# Altium project DM1098EMB_R0M0E0.PrjPcb (part 3 of 3)

## Sheet DM1098EMB_IO.SchDoc: =project_title
size Tabloid; CompanyName: Luxonis Holding; DrawnBy: Brian Weinstein; Organization: Luxonis Holding; Address1: 1925 Harmony Park Drive; Address2: Westminster, CO; Address3: 80234; Address4: United States; DocumentNumber: D1098EMB; Revision: R0M0E0; SheetNumber: 6; SheetTotal: 6
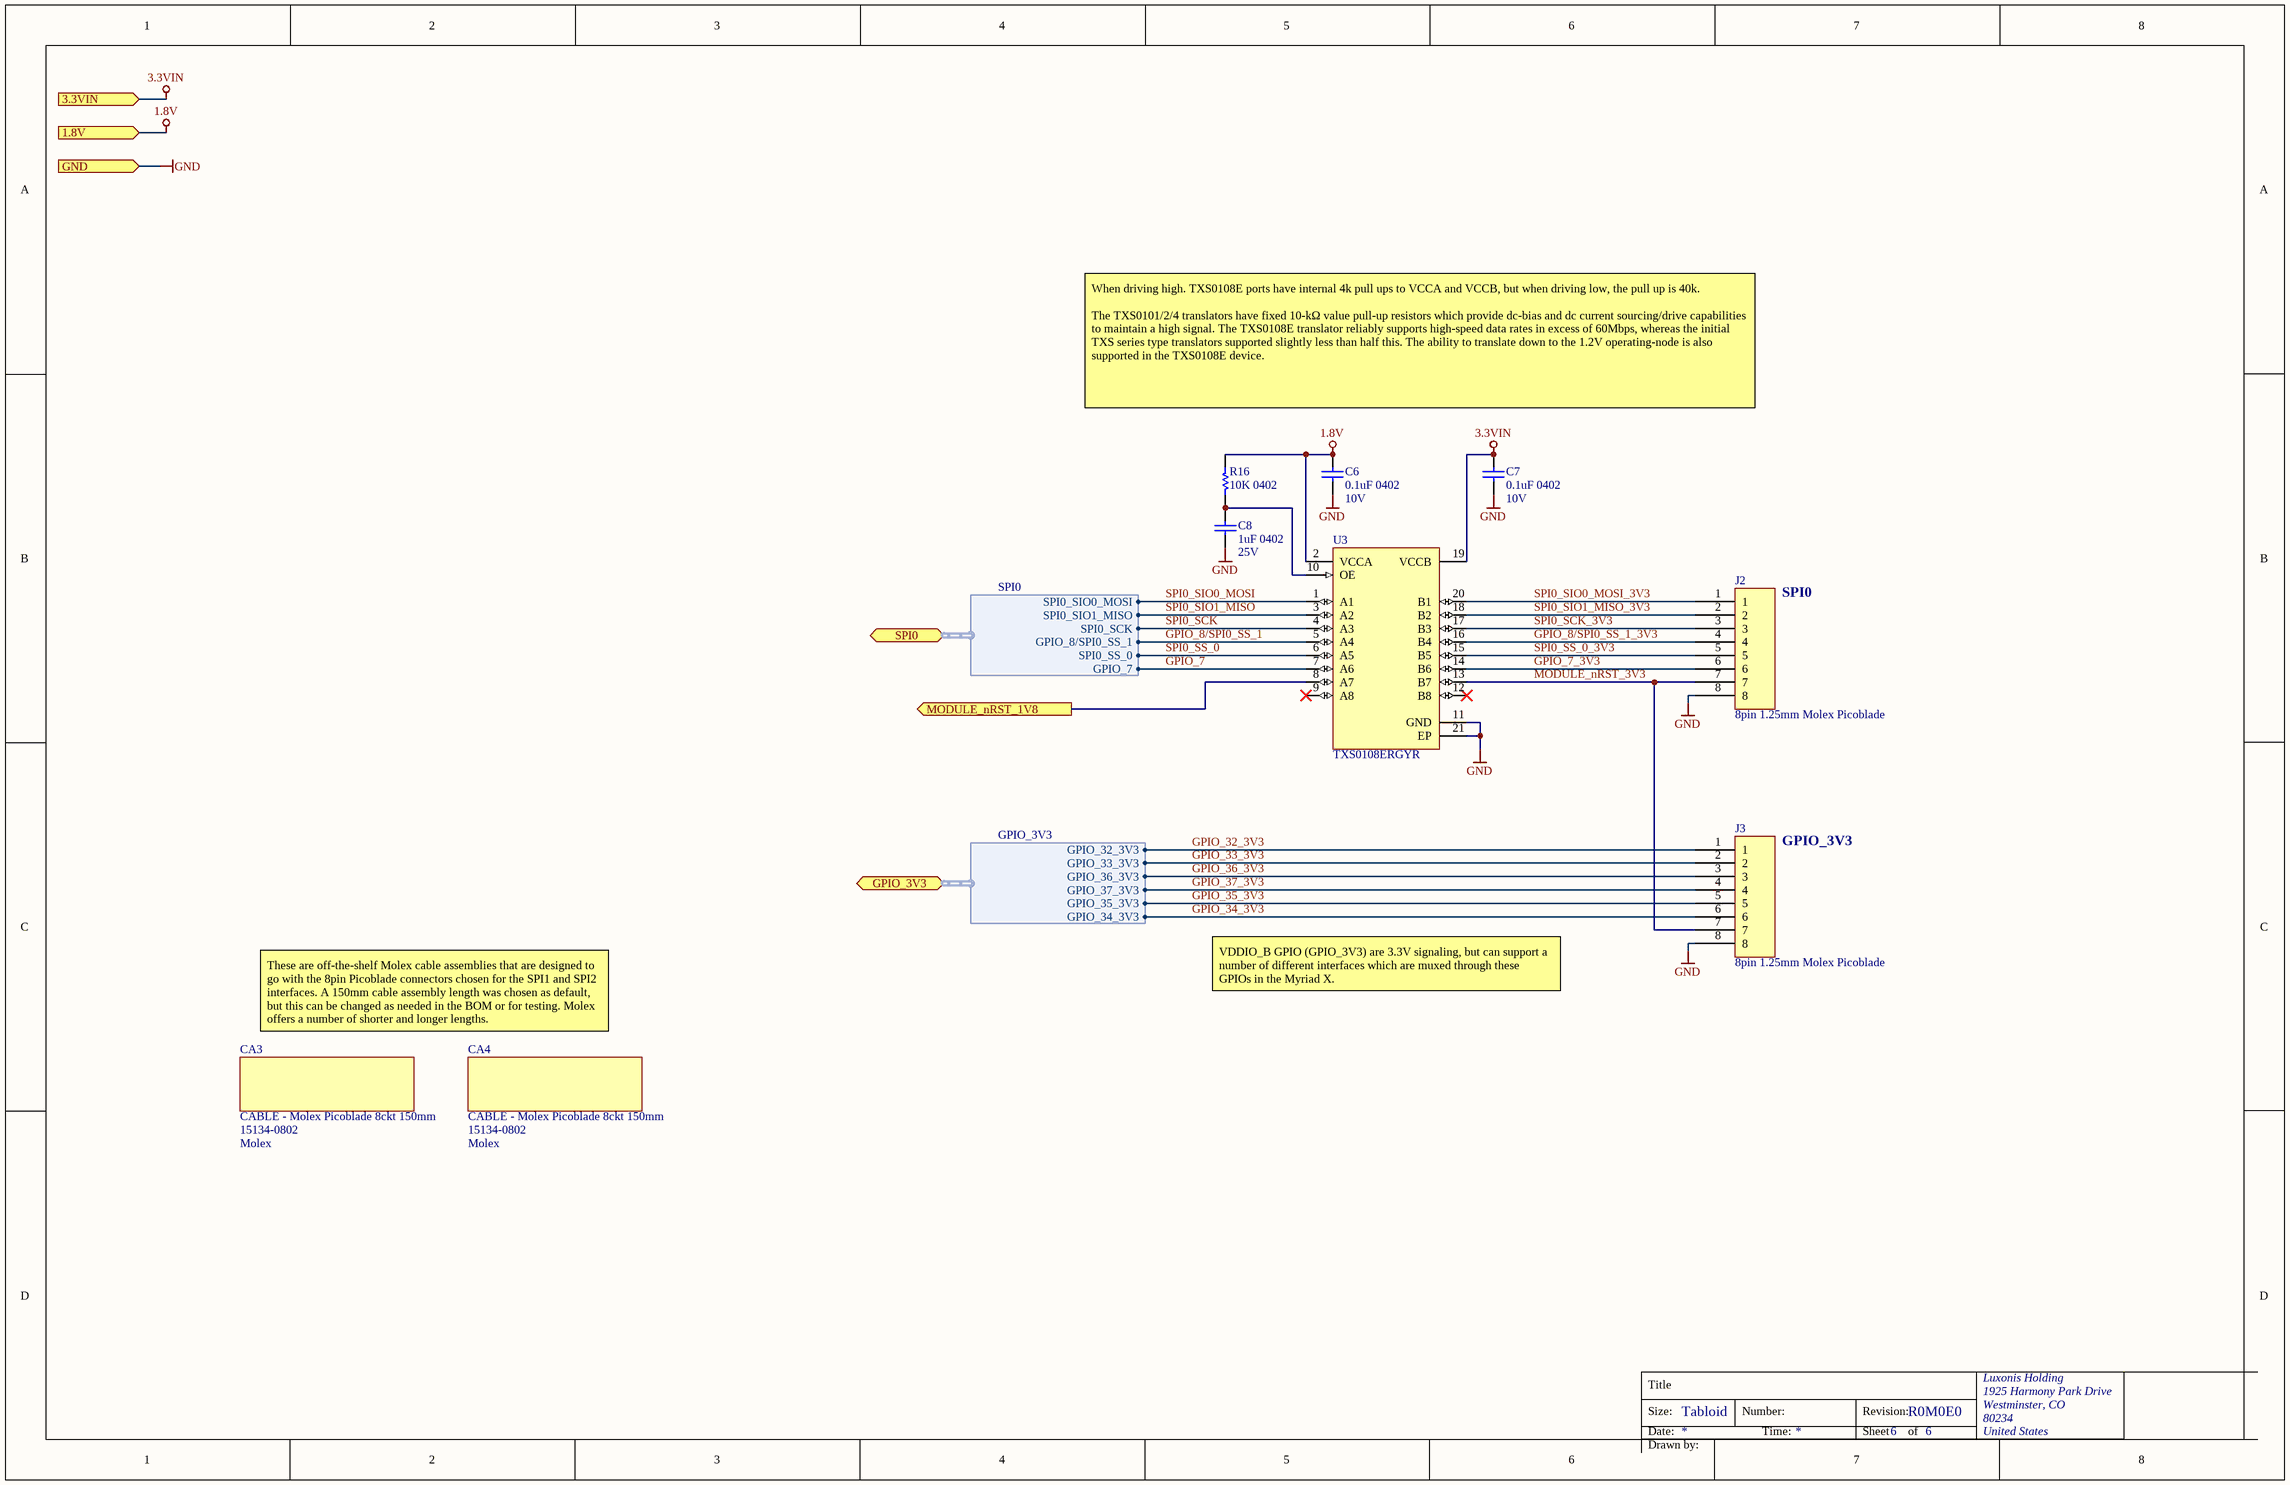
[diagram p5: DM1098EMB_IO.SchDoc]

### Parts
C6  0.1uF 0402  Voltage Rating: 10V  [CAPC0402(1005)70_N]
C7  0.1uF 0402  Voltage Rating: 10V  [CAPC0402(1005)70_N]
C8  1uF 0402  Voltage Rating: 25V  [CAPC0402(1005)70_N]
CA3  CABLE - Molex Picoblade 8ckt 150mm  Manufacturer 1: Molex  [15134-0802]  (mechanical)
CA4  CABLE - Molex Picoblade 8ckt 150mm  Manufacturer 1: Molex  [15134-0802]  (mechanical)
J2  8pin 1.25mm Molex Picoblade  [53047-0810]
J3  8pin 1.25mm Molex Picoblade  [53047-0810]
R16  10K 0402  [RESC0402(1005)_N]
U3  TXS0108ERGYR  [TXS0108ERGYR]

### Ports
1.8V (in), 3.3VIN (in), GND (in), GPIO_3V3 (bidir, harness GPIO_3V3), MODULE_nRST_1V8 (out), SPI0 (bidir, harness SPI0)

### Harnesses
SPI0: SPI0_SIO0_MOSI, SPI0_SIO1_MISO, SPI0_SCK, GPIO_8/SPI0_SS_1, SPI0_SS_0, GPIO_7
GPIO_3V3: GPIO_32_3V3, GPIO_33_3V3, GPIO_36_3V3, GPIO_37_3V3, GPIO_35_3V3, GPIO_34_3V3

### Nets
1.8V: C6.2 R16.1 U3.2(VCCA) ; port 1.8V  [project net 1V8]
3.3VIN: C7.2 U3.19(VCCB) ; port 3.3VIN
GND: C6.1 C7.1 C8.1 J2.8 J3.8 U3.11(GND) U3.21(EP) ; port GND
GPIO_7: U3.7(A6) ; port SPI0.GPIO_7
GPIO_7_3V3: J2.6 U3.14(B6)
GPIO_8/SPI0_SS_1: U3.5(A4) ; port SPI0.GPIO_8/SPI0_SS_1
GPIO_8/SPI0_SS_1_3V3: J2.4 U3.16(B4)
GPIO_32_3V3: J3.1 ; port GPIO_3V3.GPIO_32_3V3
GPIO_33_3V3: J3.2 ; port GPIO_3V3.GPIO_33_3V3
GPIO_34_3V3: J3.6 ; port GPIO_3V3.GPIO_34_3V3
GPIO_35_3V3: J3.5 ; port GPIO_3V3.GPIO_35_3V3
GPIO_36_3V3: J3.3 ; port GPIO_3V3.GPIO_36_3V3
GPIO_37_3V3: J3.4 ; port GPIO_3V3.GPIO_37_3V3
MODULE_nRST_1V8: U3.8(A7) ; port MODULE_nRST_1V8
MODULE_nRST_3V3: J2.7 J3.7 U3.13(B7)
SPI0_SCK: U3.4(A3) ; port SPI0.SPI0_SCK
SPI0_SCK_3V3: J2.3 U3.17(B3)
SPI0_SIO0_MOSI: U3.1(A1) ; port SPI0.SPI0_SIO0_MOSI
SPI0_SIO0_MOSI_3V3: J2.1 U3.20(B1)
SPI0_SIO1_MISO: U3.3(A2) ; port SPI0.SPI0_SIO1_MISO
SPI0_SIO1_MISO_3V3: J2.2 U3.18(B2)
SPI0_SS_0: U3.6(A5) ; port SPI0.SPI0_SS_0
SPI0_SS_0_3V3: J2.5 U3.15(B5)
NetC8_2: C8.2 R16.2 U3.10(OE)

Not connected (* = marked no-connect by the designer): U3 9(A8)* 12(B8)*

### Notes on the sheet
- When driving high. TXS0108E ports have internal 4k pull ups to VCCA and VCCB, but when driving low, the pull up is 40k.
  The TXS0101/2/4 translators have fixed 10-kΩ value pull-up resistors which provide dc-bias and dc current sourcing/drive capabilities to maintain a high signal. The TXS0108E translator reliably supports high-speed data rates in excess of 60Mbps, whereas the initial TXS series type translators supported slightly less than half this. The ability to translate down to the 1.2V operating-node is also supported in the TXS0108E device.
- (near J2) SPI0
- (near J3) GPIO_3V3
- These are off-the-shelf Molex cable assemblies that are designed to go with the 8pin Picoblade connectors chosen for the SPI1 and SPI2 interfaces. A 150mm cable assembly length was chosen as default, but this can be changed as needed in the BOM or for testing. Molex offers a number of shorter and longer lengths.
- VDDIO_B GPIO (GPIO_3V3) are 3.3V signaling, but can support a number of different interfaces which are muxed through these GPIOs in the Myriad X.
- Title
- Size:
- Date:
- Tabloid
- Number:
- Time:
- Revision:
- Sheet
- of
- Drawn by:

### Library data of the parts
C6 C7 = GRM155R71A104JA01D: CAP CER 0.1UF 10V X7R 0402 5%; Manufacturer 1: Murata; Capacitance: 100nF; Supplier 1: Digi-Key; Manufacturer Part Number 1: GRM155R71A104JA01D; Stock 1: 1346709; Pricing 1: 1=0.10000, 10=0.02500, 100=0.01130, 500=0.00806, 1000=0.00633, 2500=0.00575, 5000=0.00529 (USD); RoHS: Yes; Mount: Surface Mount; Case/Package: 0402; Case Code (Imperial): 0402; Case Code (Metric): 1005; Min Operating Temperature: -55°C; Max Operating Temperature: 125°C; Tolerance: 5%; Packaging: Tape and Reel; Voltage Rating (DC): 10V; Dielectric: X7R; Package Quantity: 10000; Termination: SMD/SMT; Length: 1mm; Height: 0.5mm; Width: 0.02inch; Thickness: 0.022inch; Depth: 0.5mm; Radiation Hardening: No; Lead Free: Lead Free; ComponentLink1URL: https://datasheet.ciiva.com/5411/product-5411135.pdf?src-supplier=Mouser; ComponentLink1Description: https://datasheet.ciiva.com/5411/product-5411135.pdf?src-supplier=Mouser; ComponentLink2URL: https://datasheet.ciiva.com/11618/c02e-11618821.pdf?src-supplier=Avnet; ComponentLink2Description: https://datasheet.ciiva.com/11618/c02e-11618821.pdf?src-supplier=Avnet; Supplier Part Number 1: 490-10777-1-ND
C8 = GRM155R61E105KA12D: CAP CER 1UF 25V X5R 0402 10%; Manufacturer 1: Murata; Material: Ceramic; Supplier 1: Digi-Key; Manufacturer Part Number 1: GRM155R61E105KA12D; Stock 1: 200653; Pricing 1: 1=0.10000, 10=0.07100, 100=0.03350, 500=0.02352, 1000=0.01947, 2500=0.01812, 5000=0.01658 (USD); RoHS: Yes; Mount: Surface Mount; Case/Package: 0402; Weight: 0.000212oz; Case Code (Metric): 1005; Case Code (Imperial): 0402; Min Operating Temperature: -55°C; Max Operating Temperature: 85°C; Tolerance: 10%; Capacitance: 1uF; Dielectric: X5R; Voltage Rating (DC): 25V; Packaging: Tape and Reel; Package Quantity: 10000; Termination: SMD/SMT; Voltage: 25V; Length: 1mm; Height: 0.5mm; Width: 0.5mm; Thickness: 0.022inch; Depth: 0.5mm; Lead Free: Lead Free; REACH SVHC: No SVHC; ComponentLink1URL: https://datasheet.ciiva.com/22732/1666664-22732122.pdf?src-supplier=Element14; ComponentLink1Description: https://datasheet.ciiva.com/22732/1666664-22732122.pdf?src-supplier=Element14; ComponentLink2URL: https://datasheet.ciiva.com/7719/1666664-7719006.pdf?src-supplier=Element14; ComponentLink2Description: https://datasheet.ciiva.com/7719/1666664-7719006.pdf?src-supplier=Element14; Supplier Part Number 1: 490-10017-1-ND; Supplier 2: Arrow; Supplier 3: TTI; Supplier Part Number 2: GRM155R61E105KA12D; Supplier Part Number 3: GRM155R61E105KA12D
CA3 CA4 = 15134-0802: CABLE ASSY POWER CORD, 8P CRIMP SOCKET, 150MM, BLK; Supplier 1: Digi-Key; Stock 1: 1432; Pricing 1: 1=5.34000, 10=5.12300, 25=4.69560, 50=4.48220, 100=4.26880, 250=3.73520, 500=3.62848, 1000=3.09488, 2500=2.88144 (USD); RoHS: Yes; Color: Black; ComponentLink1URL: http://www.farnell.com/datasheets/2549566.pdf?src-supplier=Farnell; ComponentLink1Description: http://www.farnell.com/datasheets/2549566.pdf?src-supplier=Farnell; Supplier 2: Mouser; Supplier Part Number 1: WM15274-ND; Supplier Part Number 2: 538-15134-0802; Manufacturer Part Number 1: 15134-0802; Lead Free: Lead Free
J2 J3 = 53047-0810: CONN HEADER VERT 8POS 1.25MM  Connector Header Through Hole 8 position 0.049" (1.25mm); Number of Contacts: 8; Contact Resistance: 20mR; Gender: Male; Current Rating: 1A; Voltage Rating: 125V; Insulation Resistance: 100MR; Glow Wire Compliant: Non-compliant; Supplier 1: Digi-Key; Manufacturer 1: Molex; Manufacturer Part Number 1: 53047-0810; Stock 1: 10707; Pricing 1: 1=0.54000, 10=0.50500, 100=0.38690, 500=0.33644, 1000=0.27756, 5000=0.24392, 10000=0.22710 (USD); RoHS: Yes; Mount: Through Hole; Case/Package: 0810; Contact Plating: Tin; Contact Material: Bronze,Brass,Tin; Color: Natural; Housing Color: Natural; Housing Material: Polyamide; Min Operating Temperature: -40°C; Max Operating Temperature: 85°C; Termination: Through Hole; Number of Rows: 1; Orientation: Vertical; Packaging: Tray; Number of Positions: 8; Package Quantity: 2000; Voltage Rating (DC): 125V; Number of Circuits: 8; Pitch: 1.25mm; Radiation Hardening: No; REACH SVHC: Unknown; Lead Free: Lead Free; Flammability Rating: UL94 V-0; ComponentLink1URL: https://datasheet.ciiva.com/30110/64290530470810-pcb-headers-30110449.pdf?src-supplier=Onlinecomponents.com; ComponentLink1Description: https://datasheet.ciiva.com/30110/64290530470810-pcb-headers-30110449.pdf?src-supplier=Onlinecomponents.com; ComponentLink2URL: https://datasheet.ciiva.com/5155/0530470810-pcb-headers-170988-5155236.pdf?src-supplier=Mouser; ComponentLink2Description: https://datasheet.ciiva.com/5155/0530470810-pcb-headers-170988-5155236.pdf?src-supplier=Mouser; ComponentLink3URL: https://datasheet.ciiva.com/11747/0900766b8024e2fd-11747012.pdf?src-supplier=RSComponents; ComponentLink3Description: https://datasheet.ciiva.com/11747/0900766b8024e2fd-11747012.pdf?src-supplier=RSComponents; ComponentLink4URL: https://datasheet.ciiva.com/25291/1815828-25291355.pdf?src-supplier=Newark; ComponentLink4Description: https://datasheet.ciiva.com/25291/1815828-25291355.pdf?src-supplier=Newark; ComponentLink5URL: https://datasheet.ciiva.com/34303/1932504-34303339.pdf?src-supplier=Jameco; ComponentLink5Description: https://datasheet.ciiva.com/34303/1932504-34303339.pdf?src-supplier=Jameco; ComponentLink6URL: https://datasheet.ciiva.com/16658/0530470810-pcb-headers-16658422.pdf?src-supplier=Avnet+Europe; ComponentLink6Description: https://datasheet.ciiva.com/16658/0530470810-pcb-headers-16658422.pdf?src-supplier=Avnet+Europe; ComponentLink7URL: https://datasheet.ciiva.com/17025/70266944-17025467.pdf?src-supplier=Allied+Electronics; ComponentLink7Description: https://datasheet.ciiva.com/17025/70266944-17025467.pdf?src-supplier=Allied+Electronics; ComponentLink8URL: https://datasheet.ciiva.com/14156/ge116819-116832-e-14156239.pdf?src-supplier=Distrelec; ComponentLink8Description: https://datasheet.ciiva.com/14156/ge116819-116832-e-14156239.pdf?src-supplier=Distrelec; Supplier 2: Mouser; Supplier Part Number 1: WM1737-ND; Supplier Part Number 2: 538-53047-0810
R16 = RC0402FR-1310KL: RES SMD 10K OHM 1% 0402 1/16W Chip Resistor, 0402 [1005 Metric], 10 kohm, RC Series, 50 V, Thick Film, 62.5 mW; Manufacturer 1: Yageo; Resistance: 10kR; Temperature Coefficient: 100ppm/°C; Power Rating: 62.5mW; Voltage Rating: 50V; ComponentLink1URL: https://datasheet.ciiva.com/16940/pyu-rc0402-51-rohs-l-6-16940293.pdf?src-supplier=Avnet+Europe; ComponentLink1Description: https://datasheet.ciiva.com/16940/pyu-rc0402-51-rohs-l-6-16940293.pdf?src-supplier=Avnet+Europe; ComponentLink2URL: https://datasheet.ciiva.com/28386/pyu-rc0402-51-rohs-l-6-28386855.pdf?src-supplier=Avnet+Europe; ComponentLink2Description: https://datasheet.ciiva.com/28386/pyu-rc0402-51-rohs-l-6-28386855.pdf?src-supplier=Avnet+Europe; ComponentLink3URL: https://datasheet.ciiva.com/16740/pyu-rc0402-51-rohs-l-6-r-16740602.pdf?src-supplier=Future+Electronics; ComponentLink3Description: https://datasheet.ciiva.com/16740/pyu-rc0402-51-rohs-l-6-r-16740602.pdf?src-supplier=Future+Electronics; ComponentLink4URL: https://datasheet.ciiva.com/8891/pyu-rc0402-51-rohs-l-6-8891339.pdf?src-supplier=Avnet; ComponentLink4Description: https://datasheet.ciiva.com/8891/pyu-rc0402-51-rohs-l-6-8891339.pdf?src-supplier=Avnet; ComponentLink5URL: https://datasheet.ciiva.com/5557/pyu-rc0402-51-rohs-l-6-r-5557997.pdf?src-supplier=Mouser; ComponentLink5Description: https://datasheet.ciiva.com/5557/pyu-rc0402-51-rohs-l-6-r-5557997.pdf?src-supplier=Mouser; ComponentLink6URL: https://datasheet.ciiva.com/7983/1018594-7983533.pdf?src-supplier=Element14; ComponentLink6Description: https://datasheet.ciiva.com/7983/1018594-7983533.pdf?src-supplier=Element14; Supplier 1: Newark; Manufacturer Part Number 1: RC0402FR-1310KL; Stock 1: 62239; Pricing 1: 1=0.10000, 25=0.01200, 100=0.00400, 250=0.00400, 500=0.00300, 1000=0.00300 (USD); RoHS: Yes; Case/Package: 0402; Number of Pins: 2; Contact Plating: Tin,Matte,Lead; Case Code (Imperial): 0402; Case Code (Metric): 1005; Min Operating Temperature: -55°C; Max Operating Temperature: 155°C; Tolerance: 1%; Composition: Thick Film; Packaging: Tape and Reel; Termination: SMD/SMT; Military Standard: Not; Voltage Rating (DC): 50V; Working Voltage: 50V; Number of Terminations: 2; Length: 1mm; Depth: 0.5mm; Radiation Hardening: No; REACH SVHC: No SVHC; Lead Free: Lead Free; Supplier Part Number 1: 67R9960; Supplier 2: Future Electronics; Supplier 3: Mouser; Supplier 4: Element14; Supplier Part Number 2: RC0402FR-1310KL-CUTT; Supplier Part Number 3: 603-RC0402FR-1310KL; Supplier Part Number 4: 1799235
U3 = TXS0108ERGYR: IC TRNSLTR BIDIRECTIONAL 20VQFN; Manufacturer 1: Texas Instruments; Logic Function: Translator; Number of Bits: 8; Turn-On Delay Time: 312ns; High Level Output Current: -50mA; Low Level Output Current: 50mA; Quiescent Current: 3uA; Propagation Delay: 4.8ns; Min Supply Voltage: 1.2V; Max Supply Voltage: 5.5V; Data Rate: 60Mbps; Output Type: Voltage; Supplier 1: Digi-Key; Manufacturer Part Number 1: TXS0108ERGYR; RoHS: Yes; Category: Integrated Circuits (ICs); Stock 1: 122729; Pricing 1: 1=1.42000, 10=1.26600, 25=1.20120, 100=0.98670, 250=0.92236, 500=0.81510, 1000=0.64350 (USD); Mount: Surface Mount; Case/Package: VQFN; Number of Pins: 20; Weight: 0.001517oz; Min Operating Temperature: -40°C; Max Operating Temperature: 85°C; Number of Inputs: 8; Packaging: Tape and Reel; Package Quantity: 1; Number of Channels: 8; Radiation Hardening: No; Lead Free: Lead Free; REACH SVHC: No SVHC; ComponentLink1URL: https://datasheet.ciiva.com/15096/getdatasheetpartid-189651-15096225.pdf?src-supplier=Verical; ComponentLink1Description: https://datasheet.ciiva.com/15096/getdatasheetpartid-189651-15096225.pdf?src-supplier=Verical; ComponentLink2URL: https://datasheet.ciiva.com/22659/1718976-22659572.pdf?src-supplier=Element14; ComponentLink2Description: https://datasheet.ciiva.com/22659/1718976-22659572.pdf?src-supplier=Element14; ComponentLink3URL: https://datasheet.ciiva.com/26185/txs0108e-26185177.pdf?src-supplier=Avnet+Europe; ComponentLink3Description: https://datasheet.ciiva.com/26185/txs0108e-26185177.pdf?src-supplier=Avnet+Europe; ComponentLink4URL: https://datasheet.ciiva.com/14287/txs0108e-14287692.pdf?src-supplier=Avnet; ComponentLink4Description: https://datasheet.ciiva.com/14287/txs0108e-14287692.pdf?src-supplier=Avnet; ComponentLink5URL: https://datasheet.ciiva.com/1899/txs0108e-1899610.pdf?src-supplier=Digi-Key; ComponentLink5Description: https://datasheet.ciiva.com/1899/txs0108e-1899610.pdf?src-supplier=Digi-Key; ComponentLink6URL: https://datasheet.ciiva.com/1899/txs0108e-1899611.pdf?src-supplier=Digi-Key; ComponentLink6Description: https://datasheet.ciiva.com/1899/txs0108e-1899611.pdf?src-supplier=Digi-Key; ComponentLink7URL: https://datasheet.ciiva.com/1899/txs0108e-1899612.pdf?src-supplier=Digi-Key; ComponentLink7Description: https://datasheet.ciiva.com/1899/txs0108e-1899612.pdf?src-supplier=Digi-Key; ComponentLink8URL: https://datasheet.ciiva.com/14287/txs0108e-14287533.pdf?src-supplier=Avnet; ComponentLink8Description: https://datasheet.ciiva.com/14287/txs0108e-14287533.pdf?src-supplier=Avnet; ComponentLink9URL: https://datasheet.ciiva.com/48701/001073880-da-01-en-ic-xlatr-volt-lv-txs0108ergyr-qfn-20-tid-48701964.pdf?src-supplier=Conrad; ComponentLink9Description: https://datasheet.ciiva.com/48701/001073880-da-01-en-ic-xlatr-volt-lv-txs0108ergyr-qfn-20-tid-48701964.pdf?src-supplier=Conrad; Supplier 2: Digi-Key; Supplier 3: Arrow; Supplier 4: TI store; Supplier 5: Mouser; Supplier Part Number 1: 296-24806-1-ND; Supplier Part Number 2: 296-24806-2-ND; Supplier Part Number 3: TXS0108ERGYR; Supplier Part Number 4: TXS0108ERGYR; Supplier Part Number 5: 595-TXS0108ERGYR

## Nets that join several sheets
1V8: DM1098EMB_TopLevel (C10.2 TP7.1 U4.5), DM1098EMB_Connector (B2.1), DM1098EMB_IO (C6.2 R16.1 U3.2)
3.3VIN: DM1098EMB_TopLevel (6 pins), DM1098EMB_USB (C74.2 R186.2 U61.6), DM1098EMB_IO (C7.2 U3.19)
GND: DM1098EMB_TopLevel (27 pins), DM1098EMB_Connector (34 pins), DM1098EMB_USB (21 pins), DM1098EMB_MIPI_CAM (40 pins), DM1098EMB_IO (7 pins)
VBUS: DM1098EMB_TopLevel (TP14.1 U2.3 U5.1), DM1098EMB_Connector (J1.53), DM1098EMB_USB (10 pins)
VDD_5V: DM1098EMB_TopLevel (12 pins), DM1098EMB_Connector (8 pins), DM1098EMB_USB (C76.2 R213.2 R214.2 U62.12), DM1098EMB_MIPI_CAM (6 pins)
2485_PGOOD: DM1098EMB_TopLevel (M3.1), DM1098EMB_Connector (J1.37 J10.5)
CAM_A_CLK_OUT: DM1098EMB_Connector (J1.28), DM1098EMB_MIPI_CAM (D9.5 D9.6 J6.10)
CAM_A_PWDN_N: DM1098EMB_Connector (J1.34), DM1098EMB_MIPI_CAM (D9.4 D9.7 J6.9)
CAM_B_CLK_OUT: DM1098EMB_Connector (J1.73), DM1098EMB_MIPI_CAM (6 pins)
CAM_B_D_PWM: DM1098EMB_Connector (J1.65), DM1098EMB_MIPI_CAM (J9.12)
CAM_B_PWDN_N: DM1098EMB_Connector (J1.67), DM1098EMB_MIPI_CAM (J8.12)
CAM_L_C_N: DM1098EMB_Connector (J1.95), DM1098EMB_MIPI_CAM (D6.5 D6.6 J8.2)
CAM_L_C_P: DM1098EMB_Connector (J1.97), DM1098EMB_MIPI_CAM (D6.4 D6.7 J8.3)
CAM_L_D0_N: DM1098EMB_Connector (J1.89), DM1098EMB_MIPI_CAM (D6.2 D6.9 J8.5)
CAM_L_D0_P: DM1098EMB_Connector (J1.91), DM1098EMB_MIPI_CAM (D6.1 D6.10 J8.6)
CAM_L_D1_N: DM1098EMB_Connector (J1.83), DM1098EMB_MIPI_CAM (D3.2 D3.9 J8.16)
CAM_L_D1_P: DM1098EMB_Connector (J1.85), DM1098EMB_MIPI_CAM (D3.1 D3.10 J8.17)
CAM_R_C_N: DM1098EMB_Connector (J1.96), DM1098EMB_MIPI_CAM (D8.5 D8.6 J9.2)
CAM_R_C_P: DM1098EMB_Connector (J1.98), DM1098EMB_MIPI_CAM (D8.4 D8.7 J9.3)
CAM_R_D0_N: DM1098EMB_Connector (J1.90), DM1098EMB_MIPI_CAM (D8.2 D8.9 J9.5)
CAM_R_D0_P: DM1098EMB_Connector (J1.92), DM1098EMB_MIPI_CAM (D8.1 D8.10 J9.6)
CAM_R_D1_N: DM1098EMB_Connector (J1.84), DM1098EMB_MIPI_CAM (D10.2 D10.9 J9.16)
CAM_R_D1_P: DM1098EMB_Connector (J1.86), DM1098EMB_MIPI_CAM (D10.1 D10.10 J9.17)
COM_AUX_IO2: DM1098EMB_Connector (J1.42 TP5.1), DM1098EMB_MIPI_CAM (R2.1)
GPIO_7: DM1098EMB_Connector (J1.59), DM1098EMB_MIPI_CAM (R1.2), DM1098EMB_IO (U3.7)
GPIO_8/SPI0_SS_1: DM1098EMB_Connector (J1.60), DM1098EMB_IO (U3.5)
GPIO_32_3V3: DM1098EMB_Connector (J1.61), DM1098EMB_IO (J3.1)
GPIO_33_3V3: DM1098EMB_Connector (J1.63), DM1098EMB_IO (J3.2)
GPIO_34_3V3: DM1098EMB_Connector (J1.40), DM1098EMB_IO (J3.6)
GPIO_35_3V3: DM1098EMB_Connector (J1.38), DM1098EMB_IO (J3.5)
GPIO_36_3V3: DM1098EMB_Connector (J1.36), DM1098EMB_IO (J3.3)
GPIO_37_3V3: DM1098EMB_Connector (J1.32), DM1098EMB_IO (J3.4)
GPIO_53: DM1098EMB_Connector (J1.69 J10.7), DM1098EMB_MIPI_CAM (R5.2)
I2C1_SCL: DM1098EMB_Connector (J1.35), DM1098EMB_MIPI_CAM (J6.6)
I2C1_SDA: DM1098EMB_Connector (J1.33), DM1098EMB_MIPI_CAM (J6.7)
I2C2_SCL: DM1098EMB_Connector (J1.77), DM1098EMB_MIPI_CAM (J8.11 J9.11)
I2C2_SDA: DM1098EMB_Connector (J1.79), DM1098EMB_MIPI_CAM (J8.10 J9.10)
MIPI_C_N: DM1098EMB_Connector (J1.3), DM1098EMB_MIPI_CAM (D7.2 D7.9 J6.18)
MIPI_C_P: DM1098EMB_Connector (J1.5), DM1098EMB_MIPI_CAM (D7.1 D7.10 J6.19)
MIPI_D0_N: DM1098EMB_Connector (J1.9), DM1098EMB_MIPI_CAM (D5.5 D5.6 J6.21)
MIPI_D0_P: DM1098EMB_Connector (J1.11), DM1098EMB_MIPI_CAM (D5.4 D5.7 J6.22)
MIPI_D1_N: DM1098EMB_Connector (J1.15), DM1098EMB_MIPI_CAM (D7.4 D7.7 J6.16)
MIPI_D1_P: DM1098EMB_Connector (J1.17), DM1098EMB_MIPI_CAM (D7.5 D7.6 J6.15)
MIPI_D2_N: DM1098EMB_Connector (J1.21), DM1098EMB_MIPI_CAM (D5.2 D5.9 J6.24)
MIPI_D2_P: DM1098EMB_Connector (J1.23), DM1098EMB_MIPI_CAM (D5.1 D5.10 J6.25)
MIPI_D3_N: DM1098EMB_Connector (J1.27), DM1098EMB_MIPI_CAM (D9.2 D9.9 J6.12)
MIPI_D3_P: DM1098EMB_Connector (J1.29), DM1098EMB_MIPI_CAM (D9.1 D9.10 J6.13)
MODULE_nRST_1V8: DM1098EMB_TopLevel (M1.1), DM1098EMB_Connector (B1.2 J1.39 TP3.1), DM1098EMB_IO (U3.8)
SPI0_SCK: DM1098EMB_Connector (J1.74), DM1098EMB_IO (U3.4)
SPI0_SIO0_MOSI: DM1098EMB_Connector (J1.62), DM1098EMB_IO (U3.1)
SPI0_SIO1_MISO: DM1098EMB_Connector (J1.64), DM1098EMB_IO (U3.3)
SPI0_SS_0: DM1098EMB_Connector (J1.70), DM1098EMB_IO (U3.6)
USB_D_N: DM1098EMB_Connector (J1.18), DM1098EMB_USB (J14.A7 J14.B7)
USB_D_P: DM1098EMB_Connector (J1.16), DM1098EMB_USB (J14.A6 J14.B6)
USB_RX_N: DM1098EMB_Connector (J1.12), DM1098EMB_USB (U61.4)
USB_RX_P: DM1098EMB_Connector (J1.10), DM1098EMB_USB (U61.3)
USB_TX_N: DM1098EMB_Connector (J1.24), DM1098EMB_USB (U61.8)
USB_TX_P: DM1098EMB_Connector (J1.22), DM1098EMB_USB (U61.7)

## Assembly variants
Production: not fitted MISC1 R1 R5 RZ28 RZ29